# Altium project H01R0.PrjPcb (part 2 of 2)

## Sheet H01R0_Frontend 1.SchDoc
size Letter; CompanyName: Hexabitz; DocumentNumber: 2; SheetNumber: 2; SheetTotal: 3
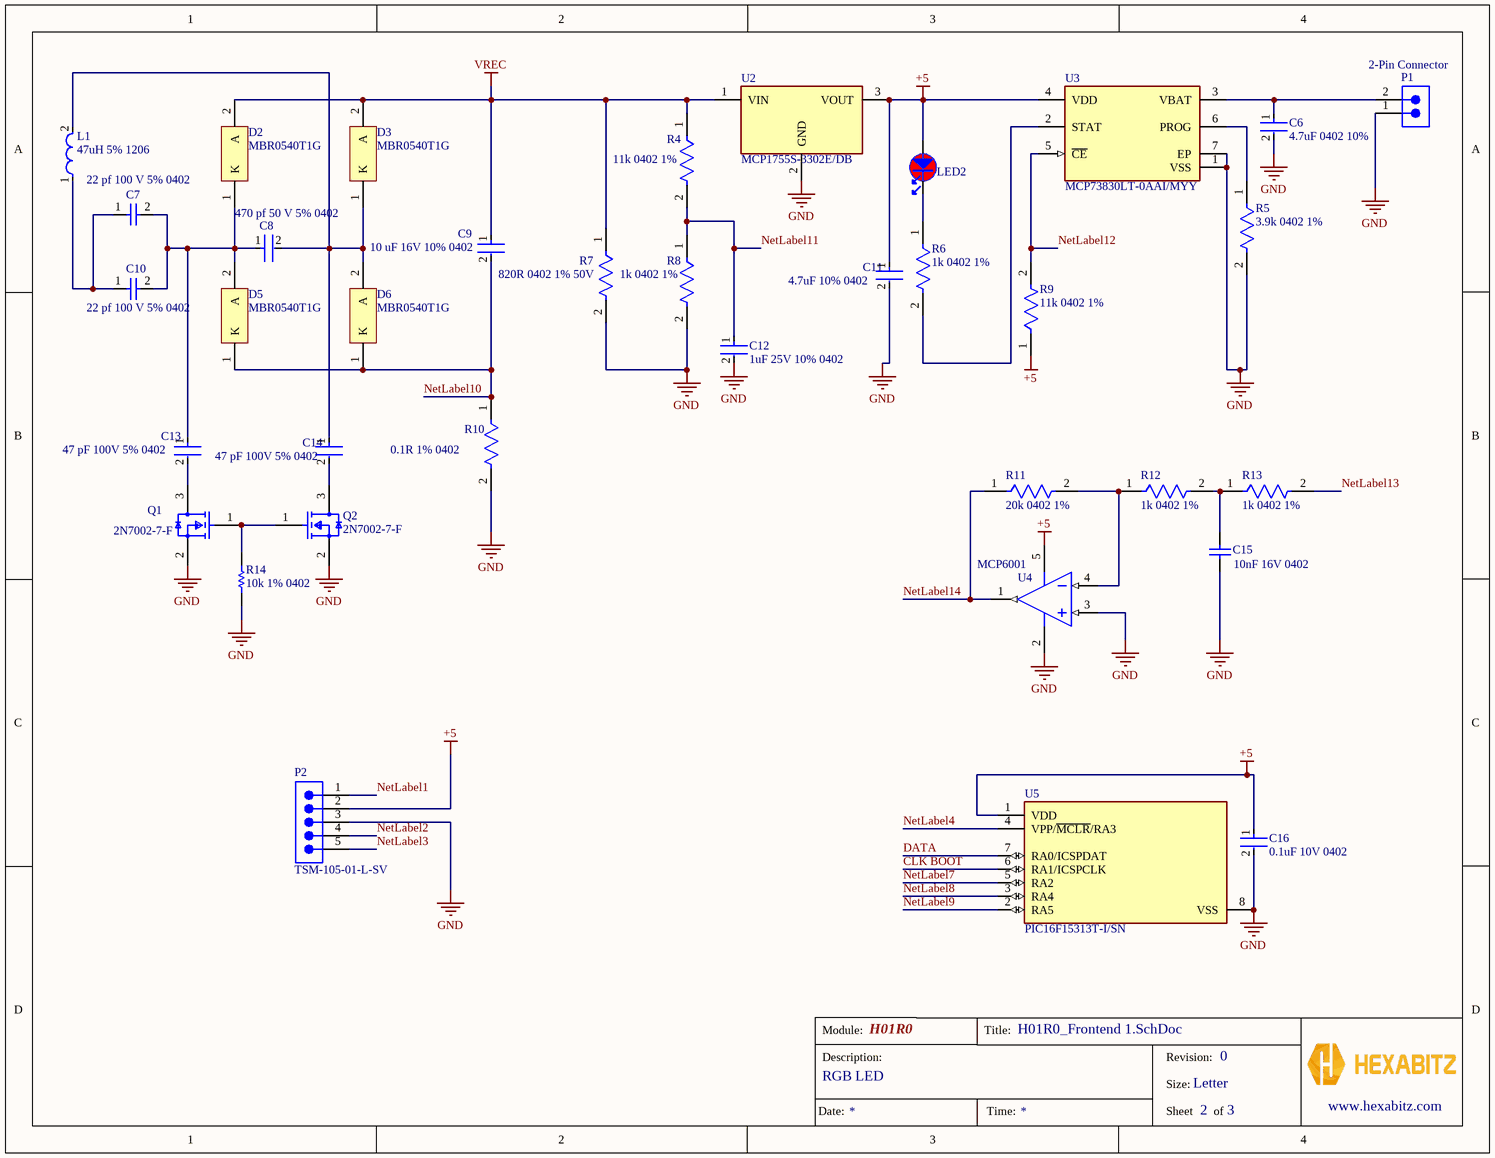
[diagram p1: H01R0_Frontend 1.SchDoc]

### Parts
C6  4.7uF 0402 10%  [FP-GRM188-0_2-IPC_A]
C7  22 pf 100 V 5% 0402  [CAPC1005X61X26LL10T16]
C8  470 pf 50 V 5% 0402  [FP-C0402-BB-MFG]
C9  10 uF 16V 10% 0402  [FP-GRM21B-0_1-IPC_B]
C10  22 pf 100 V 5% 0402  [CAPC1005X61X26LL10T16]
C11  4.7uF 10% 0402  [FP-GRM188-0_2-IPC_A]
C12  1uF 25V 10% 0402  [FP-GRM155-0_05-IPC_C]
C13  47 pF 100V 5% 0402  [FP-GQM155-0_05-IPC_A]
C14  47 pF 100V 5% 0402  [FP-GQM155-0_05-IPC_A]
C15  10nF 16V 0402  [CAPC1005X60X26LL10T16]
C16  0.1uF 10V 0402  [FP-C0402-BB-MFG]
D2  MBR0540T1G  [ONSC-SOD-123-2-425-04_V]
D3  MBR0540T1G  [ONSC-SOD-123-2-425-04_V]
D5  MBR0540T1G  [ONSC-SOD-123-2-425-04_V]
D6  MBR0540T1G  [ONSC-SOD-123-2-425-04_V]
L1  47uH 5% 1206  [FP-LQH31CN_03-MFG]
LED2  VLMS1300-GS08  [FP-6_541-5092_01-4-MFG]  (value not drawn)
P1  2-Pin Connector  [679302124022]
P2  TSM-105-01-L-SV  [SMTC-TSM-105-01-X-SV]
Q1  2N7002-7-F  [FP-SOT23-MFG]
Q2  2N7002-7-F  [FP-SOT23-MFG]
R4  11k 0402 1%  [FP-CRCW0402-e3-IPC_B]
R5  3.9k 0402 1%  [FP-RN73R1E-IPC_C]
R6  1k 0402 1%  [FP-AC0402-IPC_C]
R7  820R 0402 1% 50V  [FP-MCS0402-IPC_C]
R8  1k 0402 1%  [FP-RNCP0402-IPC_C]
R9  11k 0402 1%  [FP-CRCW0402-e3-IPC_B]
R10  0.1R 1% 0402  [FP-CSR0402-IPC_A]
R11  20k 0402 1%  [FP-TFCR0402-IPC_A]
R12  1k 0402 1%  [FP-RNCP0402-IPC_C]
R13  1k 0402 1%  [FP-RNCP0402-IPC_C]
R14  10k 1% 0402  [RESC1005X40X25LL10T10]
U2  MCP1755S-3302E/DB  [FP-C04-032-MFG]
U3  MCP73830LT-0AAI/MYY  [FP-C04-078-IPC_C]
U4  MCP6001  [SOT-23-OT5_L]
U5  PIC16F15313T-I/SN  [FP-C04-057-MFG]

### Nets
+5: C11.1 C16.1 LED2.2 P2.2 R9.1 U2.3(VOUT) U3.4(VDD) U4.5(VDD) U5.1(VDD)
GND: C6.2 C11.2 C12.2 C15.2 C16.2 P1.1 P2.3 Q1.2(S) Q2.2(S) R5.2 R7.2 R8.2 R10.2 R14.1 U2.2(GND) U3.1(VSS) U3.7(EP) U4.2(VSS) U4.3(VIN+) U5.8(VSS)
VREC: C9.1 D2.2(A) D3.2(A) R4.1 R7.1 U2.1(VIN)
CLK BOOT: U5.6(RA1/ICSPCLK)
DATA: U5.7(RA0/ICSPDAT)
NetLabel1: P2.1
NetLabel2: P2.4
NetLabel3: P2.5
NetLabel4: U5.4(VPP/~{MCLR}/RA3)
NetLabel7: U5.5(RA2)
NetLabel8: U5.3(RA4)
NetLabel9: U5.2(RA5)
NetLabel10: C9.2 D5.1(K) D6.1(K) R10.1
NetLabel11: C12.1 R4.2 R8.1
NetLabel12: R9.2 U3.5(~{CE})
NetLabel13: R13.2
NetLabel14: R11.1 U4.1(VOUT)
NetC6_1: C6.1 P1.2 U3.3(VBAT)
NetC7_1: C7.1 C10.1 L1.1
NetC7_2: C7.2 C8.1 C10.2 C13.1 D2.1(K) D5.2(A)
NetC8_2: C8.2 C14.1 D3.1(K) D6.2(A) L1.2
NetC13_2: C13.2 Q1.3(D)
NetC14_2: C14.2 Q2.3(D)
NetC15_1: C15.1 R12.2 R13.1
NetLED2_1: LED2.1 R6.1
NetQ1_1: Q1.1(G) Q2.1(G) R14.2
NetR5_1: R5.1 U3.6(PROG)
NetR6_2: R6.2 U3.2(STAT)
NetR11_2: R11.2 R12.1 U4.4(VIN-)

### Notes on the sheet
- Module:
- Title:
- Description:
- Size:
- Revision:
- Letter
- www.hexabitz.com
- Date:
- Time:
- Sheet
- of

### Library data of the parts
C6 C11 = CMP-06035-002362-1: Chip Multilayer Ceramic Capacitors for General Purpose, 0603, 4.7uF, X7S, 22%, 10%, 16V; Capacitance: 4.7uF; Dielectric: X7S; Voltage Rating (DC): 16V; Thickness: 800um; Tolerance: 10%; Length: 1.6mm; Width: 800um
C7 C10 = CMP-2008-02000-1: Manufacturer: Vitramon; Part Number: VJ0402D220JXBAJ
C8 = CMP-03020-013778-2: C0402 470 pF C0G 0.05 50 V; Manufacturer Part Number: C0402C471J5GAC; Manufacturer: Kemet; Value: 470 pF; Material: Ceramic; Voltage Rating: 50 V; Tolerance: 0.05; Package: C0402-BB; Device Class L3: Ceramic Capacitors; Capacitance: 470 pF; Temperature Range High: +125°C; Temperature: -55°C to +125°C; Temperature Range Low: -55°C; ComponentLink2Description: Datasheet; Device Class L2: Capacitors; Lead Free: Yes; Category: Cap; Automotive: No; Height: 0.55mm; Ipc Land Pattern Name: CAPC10050X50; Device Class L1: Passive Components; ComponentLink2URL: https://content.kemet.com/datasheets/KEM_C1002_X7R_SMD.pdf; RoHS: TRUE; Temperature Characteristic: C0G; Octopart: https://octopart.com/c0402c471j5gac-kemet-29626191; Mouser Description: Cap Ceramic 470pF 50V C0G 5% Pad SMD 0402 125C Bulk
C9 = CMP-2007-03503-2: Chip Multilayer Ceramic Capacitors for General Purpose, 0805, 10uF, X6S, 22%, 10%, 16V; Capacitance: 10uF; Termination: SMD/SMT; Min Operating Temperature: -55°C; REACH SVHC: No SVHC; Voltage: 16V; Thickness: 0.053inch; Voltage Rating (DC): 16V; Lead Free: Lead Free; Tolerance: 10%; Packaging: Tape and Reel; Package Quantity: 3000; Max Operating Temperature: 105°C; Height: 1.25mm; Case Code (Metric): 2012; Case Code (Imperial): 0805; Dielectric: X6S; Weight: 0.000335oz; Depth: 1.25mm; Width: 0.049inch; Voltage Rating: 16V; Case/Package: 0805; Mount: Surface Mount; Length: 2mm
C12 = CMP-06035-057649-1: Chip Multilayer Ceramic Capacitors for General Purpose, 0402, 1.0uF, B, 10%, 10%, 25V; Capacitance: 1uF; Length: 1mm; Width: 500um; Thickness: 500um; Voltage Rating (DC): 25V; Tolerance: 10%
C13 C14 = CMP-06035-010628-1: Ceramic Capacitor 47pF  ±5% 100VDC C0G 0402 Paper T/R; Min Operating Temperature: -55°C; Voltage Rating: 100V; Capacitance: 47pF; Dielectric: C0G; Length: 0.039inch; Mount: Surface Mount; Width: 0.02inch; Voltage Rating (DC): 100V; Thickness: 0.022inch; Packaging: Tape and Reel; Case/Package: 0402; Max Operating Temperature: 125°C; Tolerance: 5%
C15 = CMP-2008-02025-1: Manufacturer: Vitramon; Part Number: VJ0402Y103KXJAC
C16 = CMP-03020-002733-1: CAP CER 0.1UF 10V X7R 0402; Manufacturer: Kemet; Manufacturer Part Number: C0402C104K8RACAUTO; Material: Ceramic; Value: 0.10 μF; Tolerance: 0.1; Description: C0402 0.10 μF X7R 10.00% 10 V; Temperature Coefficient: 15%; ComponentLink2Description: Datasheet; Automotive: No; Digikey Description: CAP CER 0.1UF 10V X7R 0402; Temperature Range Low: -55°C; Ipc Land Pattern Name: CAPC10050X50; Lead Free: Yes; Category: Cap; Package: C0402-BB; Octopart: https://octopart.com/c0402c104k8racauto-kemet-9145167; Voltage Rating: 10 V; Device Class L2: Capacitors; Capacitance: 0.10 μF; Temperature Range High: +125°C; Height: 0.55mm; ComponentLink2URL: https://content.kemet.com/datasheets/KEM_C1002_X7R_SMD.pdf; Temperature: -55°C to +125°C; Device Class L1: Passive Components; Temperature Characteristic: X7R; RoHS: TRUE; Device Class L3: Ceramic Capacitors
D2 D3 D5 D6 = CMP-1055-00401-1: Schottky Power Rectifier, 2-Pin SOD-123, Pb-Free, Tape and Reel; Manufacturer: On Semiconductor; IFSM Max (A): 5.5; Configuration: Single; ComponentLink1URL: http://www.onsemi.com/; ComponentLink3Description: Package Specification; RoHS: TRUE; PackageVersion: Rev. G, 10/2009; DatasheetVersion: Rev. 7; ComponentLink3URL: http://www.onsemi.com/pub_link/Collateral/425-04.PDF; Packing: Tape and Reel; ComponentLink1Description: Manufacturer URL; PackageDescription: 2-Pin SOD, Body 1.6 x 2.69 mm; PartNumber: MBR0540T1G; ComponentLink2Description: Datasheet; ComponentLink2URL: http://www.onsemi.cn/pub_link/Collateral/MBR0540T1-D.PDF; PackageReference: SOD-123-2-425-04; Mounting Technology: Surface Mount
L1 = CMP-06042-003344-1: Wire Wound Ferrite Inductor for General Circuits 47μH ±5% 10.4Ω 55mA 1206; Shielding: Unshielded; Self Resonant Frequency: 10MHz; Q Factor: 40; DC Resistance (DCR): 8R; Test Frequency: 1MHz; Tolerance: 5%; Case Code (Imperial): 1206; Max Operating Temperature: 85°C; Min Operating Temperature: -40°C; Military Standard: Not; Inductance: 47uH; DC Current: 55mA; Height - Seated (Max): 0.079inch; Width: 0.063inch; Radiation Hardening: No; Mount: Surface Mount; Case/Package: 1206; Core Material: Ferrite; Packaging: Tape and Reel; Case Code (Metric): 3216; Weight: 0.001023oz; Current Rating: 55mA; Height: 1.8mm; Termination: SMD/SMT; Package Quantity: 2000; Length: 0.126inch; Resistor Type: Wirewound; Max DC Current: 55mA; Depth: 1.8mm
LED2 = VLMS1300-GS08: LED Uni-Color Super Red 639nm 2-Pin Chip 0603(1608Metric) T/R; Manufacturer: Vishay Semiconductors; Library: Hexabitz; Viewing Angle: 130°; Lens Style: Rectangular,Clear; Number of LEDs: 1; Luminous Intensity: 54mcd; Forward Voltage: 2V; Wavelength: 631nm; Forward Current: 20mA; Power Rating: 75mW; Supplier: Digikey; Supplier Part Number: VLMS1300-GS08DKR-ND; Manufacturer Part Number: VLMS1300-GS08; RoHS: Yes; Category: LEDs; Stock: 56745; Pricing: 1=0.21, 10=0.143, 100=0.0998, 500=0.07982, 1000=0.07322 (USD); Mounting Technology: Surface Mount; Case/Package: 0603; Color: Red; Case Code (Metric): 1608; Case Code (Imperial): 0603; Min Operating Temperature: -35°C; Max Operating Temperature: 85°C; Package Quantity: 1; Packaging: Tape and Reel; Illumination Color: Red; Dominant Wavelength: 631nm; Test Current: 20mA; Series: CHipLED; Length: 1.6mm; Width: 0.8mm; Height: 0.8mm; Radiation Hardening: No; Lead Free: Lead Free; RoHS Compliant: Yes; Reach SVHC Compliant: Unknown; ComponentLink1URL: https://datasheet.ciiva.com/26322/vlmo1300-26322153.pdf?src-supplier=Element14; ComponentLink1Description: https://datasheet.ciiva.com/26322/vlmo1300-26322153.pdf?src-supplier=Element14; ComponentLink2URL: https://datasheet.ciiva.com/8028/vlmo1300-8028047.pdf?src-supplier=Element14; ComponentLink2Description: https://datasheet.ciiva.com/8028/vlmo1300-8028047.pdf?src-supplier=Element14; ComponentLink3URL: https://datasheet.ciiva.com/9333/vlmo1300-9333743.pdf?src-supplier=Avnet; ComponentLink3Description: https://datasheet.ciiva.com/9333/vlmo1300-9333743.pdf?src-supplier=Avnet; ComponentLink4URL: https://datasheet.ciiva.com/16510/vlmo1300-16510985.pdf?src-supplier=Future+Electronics; ComponentLink4Description: https://datasheet.ciiva.com/16510/vlmo1300-16510985.pdf?src-supplier=Future+Electronics; ComponentLink5URL: https://datasheet.ciiva.com/2114/vlmo1300-2114930.pdf?src-supplier=Digikey; ComponentLink5Description: https://datasheet.ciiva.com/2114/vlmo1300-2114930.pdf?src-supplier=Digikey; ComponentLink6URL: https://datasheet.ciiva.com/2114/vlmo1300-2114931.pdf?src-supplier=Digikey; ComponentLink6Description: https://datasheet.ciiva.com/2114/vlmo1300-2114931.pdf?src-supplier=Digikey; ComponentLink7URL: https://datasheet.ciiva.com/2114/vlmo1300-2114929.pdf?src-supplier=Digikey; ComponentLink7Description: https://datasheet.ciiva.com/2114/vlmo1300-2114929.pdf?src-supplier=Digikey; Supplier 1: Digikey; Supplier Part Number 1: VLMS1300-GS08DKR-ND
P1 = CMP-1502-00721-2: NexarPartId: 18818281; Number of Positions: 2; Connector Type: Male Pin; Contact Resistance: 20mΩ; Operating Supply Voltage: 50V; Insulation: Insulated; Gender: Male; Pitch: 1.5mm; Insulation Resistance: 100MΩ; Current Rating: 1A; Flammability Rating: UL94 V-0; Contact Gender: Male; Orientation: Vertical; Color: Beige, White; Termination: SMD/SMT; Length: 6mm; Width: 6mm; Packaging: Tape and Reel; Contact Material: Copper; Contact Plating: Tin; Mount: Surface Mount; Max Operating Temperature: 85°C; Number of Pins: 2; Voltage Rating: 50V; Housing Material: Nylon; Number of Contacts: 2; Number of Rows: 1; Height: 5mm; Lead Pitch: 1.5mm; REACH SVHC: Unknown; RoHS: Compliant; Min Operating Temperature: -25°C
P2 = CMP-1024-00241-1: 0.025" SQ Post Header, Surface Mount, Vertical, -55 to 125 degC, 2.54 mm Pitch, 5-Pin, Male, RoHS; Manufacturer: Samtec; Pitch: 2.54 mm; Temperature Range: -55 to 125 degC; ComponentLink3Description: Package Specification; ComponentLink1Description: Manufacturer URL; RoHS: True; PackageDescription: Single Row .100 SMT Assembly; PackageReference: TSM-105-01-X-SV; PartNumber: TSM-105-01-L-SV; ComponentLink1URL: http://www.samtec.com; ComponentLink2URL: http://www.samtec.com/documents/webfiles/pdf/TSM.PDF; Orientation: Vertical; PackageVersion: BP, 8/2002; ComponentLink3URL: http://www.samtec.com/documents/webfiles/cpdf/TSM-1XX-XX-XXX-SV-XX-XXX-XX-MKT.pdf; ComponentLink2Description: Datasheet; DatasheetVersion: F-214; Mounting Technology: Surface Mount
Q1 Q2 = CMP-2000-04929-2: MOSFET N-CH 60V 115MA SOT23-3; Turn-On Delay Time: 7ns; Turn-Off Delay Time: 11ns; Drain to Source Resistance: 7.5R; Rise Time: 3ns; Drain to Source Breakdown Voltage: 70V; Input Capacitance: 50pF; Number of Elements: 1; Power Dissipation: 540mW; Max Power Dissipation: 300mW; Fall Time: 5.6ns; Gate to Source Voltage (Vgs): 20V; Threshold Voltage: 2.5V; Element Configuration: Single; Termination: SMD/SMT; Weight: 0.000282oz; Radiation Hardening: No; Max Operating Temperature: 150°C; On-State Resistance: 7.5R; Mount: Surface Mount; Current Rating: 115mA; Contact Plating: Tin; Lead Free: Lead Free; Min Operating Temperature: -55°C; Number of Pins: 3; REACH SVHC: No SVHC; Drain to Source Voltage (Vdss): 60V; Width: 1.3mm; Package Quantity: 3000; Length: 2.9mm; Case/Package: SOT-23; Number of Channels: 1; Dual Supply Voltage: 60V; Packaging: Tape and Reel; Height: 1mm; Voltage Rating (DC): 60V; Nominal Vgs: 2.5V; Continuous Drain Current (ID): 115mA; Voltage: 60V; Rds On Max: 7.5R
R4 R9 = CMP-02407-002513-1: RES Thick Film, 11kΩ, 1%, 0.063W, 100ppm/°C, 0402; Max Power Dissipation: 63mW; Resistance: 11kR; Composition: Thick Film; Min Operating Temperature: -55°C; Features: Automotive AEC-Q200; Packaging: Tape and Reel; Lead Free: Lead Free; Length: 0.039inch; Tolerance: 1%; Case/Package: 0402; Temperature Coefficient: 100ppm/°C; Max Operating Temperature: 155°C; Package Quantity: 50000; Width: 0.02inch; Height: 0.016inch; Number of Terminations: 2
R5 = CMP-04015-061446-1: 3.9kΩ ±1% 0.063W, 1/16W Chip Resistor 0402 (1005 Metric) Moisture Resistant Thin Film
R6 = CMP-03412-047873-1: RES 1kΩ ±1% 0.063W 0402; RoHS Compliant: Yes
R7 = CMP-02407-004026-1: RES SMD 1.2K OHM 1% 1/10W 0402; Max Power Dissipation: 100mW; Temperature Coefficient: 50ppm/°C; Width: 0.02inch; Min Operating Temperature: -55°C; Contact Plating: Tin; Height: 0.015inch; Case/Package: 0402; Length: 0.039inch; Military Standard: Not; Package Quantity: 10000; Lead Free: Lead Free; Radiation Hardening: No; Resistance: 820R; Max Operating Temperature: 125°C; Depth: 0.5mm; Composition: Thin Film; Tolerance: 1%; Packaging: Tape and Reel; Number of Terminations: 2
R8 R12 R13 = CMP-26527-002183-1: 1kΩ ±1% 0.1W 0402 High Power Anti-Sulfur Thin Film Chip Resistor; Mount: Surface Mount; Tolerance: 1%; Min Operating Temperature: -55°C; Max Operating Temperature: 155°C
R10 = CMP-26527-000729-1: General Purpose Thick Film Chip Resistor, 0402, 0.1Ω, 1%, 200ppm/°C, 0.125W; Resistance: 100mR; Max Power Dissipation: 125mW; Case/Package: 0402; Series: CSR; Length: 0.039inch; Width: 0.02inch; Max Operating Temperature: 155°C; Packaging: Tape and Reel; RoHS Compliant: Yes; Mount: Surface Mount; Resistor Type: Thick Film; Contact Plating: Tin; Tolerance: 1%; Package Quantity: 10000; Min Operating Temperature: -55°C; Height: 0.017inch; Number of Terminations: 2; Radiation Hardening: No; Temperature Coefficient: 200ppm/°C
R11 = CMP-250906-149647-1: RES Thin Film,  20kΩ, 1%, 0.063W, 50ppm/°C, 0402
R14 = CMP-2002-04584-1: Manufacturer: KOA Speer; Part Number: SG73P1ETTP1002F
U2 = CMP-06324-000158-1: IC REG LIN 3.3V 300MA SOT223-3; Number of Regulators: 1; Quiescent Current: 100uA; Nominal Supply Current: 68uA; Dropout Voltage: 300mV; Tolerance: 2%; Power Supply Rejection Ratio (PSRR): 80dB; Min Input Voltage: 3.6V; Max Supply Current: 400uA; Polarity: Positive; Max Input Voltage: 16V; Output Type: Fixed; Reach SVHC Compliant: Yes; Min Operating Temperature: -40°C; Number of Pins: 3; Weight: 0.008826oz; Length: 6.7mm; RoHS Compliant: Yes; Packaging: Rail/Tube; Package Quantity: 78; Case/Package: SOT-223-3; Number of Outputs: 1; Output Current: 300mA; Accuracy: 2%; Series: -; Max Operating Temperature: 125°C; Width: 3.7mm; Supply Current: 68uA; Mount: Surface Mount; Output Configuration: Positive; Height: 1.7mm; Nominal Output Voltage: 3.3V; Lead Free: Lead Free; Output Voltage: 3.3V; Max Output Current: 300mA
U3 = CMP-06318-000013-1: IC BATT CHG LI-ION 1CELL 6TDFN; Max Supply Voltage: 6V; Min Supply Voltage: 3.75V; Max Operating Temperature: 125°C; Packaging: Tape and Reel; Lead Free: Lead Free; Radiation Hardening: No; Package Quantity: 3000; Mount: Surface Mount; RoHS Compliant: Yes; Number of Pins: 6; Min Operating Temperature: -40°C
U4 = CMP-0187-00458-3: None; Output Current: 23mA; Number of Circuits: 1; Input Offset Voltage-Max: 4.5mV; Nominal Supply Current: 100uA; Min Supply Voltage: 1.8V; Voltage: 6V; Operating Supply Voltage: 5.5V; Gain Bandwidth Product: 1MHz; Amplifier Type: GENERAL PURPOSE; Voltage Gain: 112dB; Slew Rate: 0.6V/µs; Power Supply Rejection Ratio (PSRR): 86dB; Input Bias Current: 1pA; Common Mode Rejection Ratio: 60dB; Package Quantity: 3000; Lead Free: Lead Free; Case/Package: SOT-23; Max Operating Temperature: 125°C; RoHS Compliant: Yes; Radiation Hardening: No; Number of Channels: 1; Length: 3.1mm; Height: 1.3mm; Output Current per Channel: 23mA; Supply Current: 100uA; Packaging: Tape and Reel; Technology: CMOS; Number of Elements: 1; Number of Pins: 5; Input Offset Voltage (Vos): 4.5mV; Width: 1.8mm; Contact Plating: Tin; Mount: Surface Mount; Slew Rate-Nom: 0.6V/µs; Unity Gain Bandwidth Product: 1MHz; REACH SVHC: No SVHC; Number of Amplifiers: 1; Max Supply Voltage: 6V; Operating Supply Current: 100uA; Min Operating Temperature: -40°C; Bandwidth: 1MHz
U5 = CMP-06276-000227-1: IC MCU 8BIT 3.5KB FLASH 8SOIC; Core Architecture: PIC; Peripherals: Brown-out Detect/Reset; Interface: I2C; Oscillator Type: Internal; Frequency: 32MHz; Number of I/Os: 6; Number of Pins: 8; RoHS Compliant: Yes; Packaging: Cut Tape; Memory Type: FLASH; Min Operating Temperature: -40°C; Memory Size: 3.5KB; Case/Package: SOIC; Max Operating Temperature: 85°C

## Nets that join several sheets
GND: H01R0_Backend (17 pins), H01R0_Frontend 1 (20 pins)
DATA: H01R0_Backend (J1.2 U1.35), H01R0_Frontend 1 (U5.7)